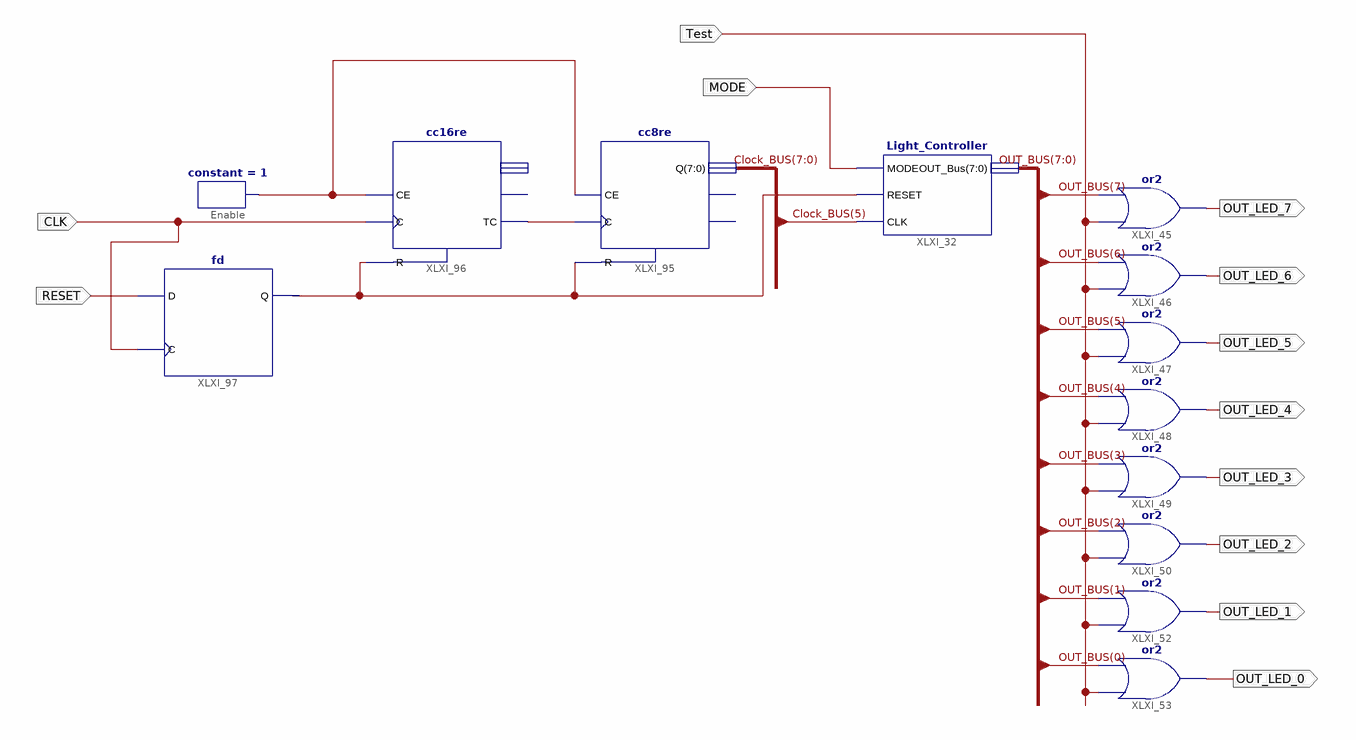
[diagram p0: schematic sheet 1]
// Xilinx ISE schematic Top_Level.sch (spartan3a) as structural Verilog: 13 symbols, 12 ports
module Top_Level (
  input  MODE,
  input  Test,
  input  CLK,
  input  RESET,
  output OUT_LED_7,
  output OUT_LED_6,
  output OUT_LED_5,
  output OUT_LED_4,
  output OUT_LED_3,
  output OUT_LED_2,
  output OUT_LED_1,
  output OUT_LED_0
);

  wire XLXN_74, XLXN_76, XLXN_112;
  wire [7:0] Clock_BUS, OUT_BUS;

  constant #(.CValue("1")) Enable (.O(XLXN_74));
  Light_Controller XLXI_32 (.MODE(MODE), .RESET(XLXN_76), .CLK(Clock_BUS[5]), .OUT_Bus(OUT_BUS));
  or XLXI_45 (OUT_LED_7, Test, OUT_BUS[7]);
  or XLXI_46 (OUT_LED_6, Test, OUT_BUS[6]);
  or XLXI_47 (OUT_LED_5, Test, OUT_BUS[5]);
  or XLXI_48 (OUT_LED_4, Test, OUT_BUS[4]);
  or XLXI_49 (OUT_LED_3, Test, OUT_BUS[3]);
  or XLXI_50 (OUT_LED_2, Test, OUT_BUS[2]);
  or XLXI_52 (OUT_LED_1, Test, OUT_BUS[1]);
  or XLXI_53 (OUT_LED_0, Test, OUT_BUS[0]);
  cc8re XLXI_95 (.C(XLXN_112), .CE(XLXN_74), .R(XLXN_76), .Q(Clock_BUS));  // open: CEO, TC
  cc16re XLXI_96 (.C(CLK), .CE(XLXN_74), .R(XLXN_76), .TC(XLXN_112));  // open: CEO, Q
  fd XLXI_97 (.C(CLK), .D(RESET), .Q(XLXN_76));
endmodule
